# EAGLE design ACC (EAGLE 9.6.2)
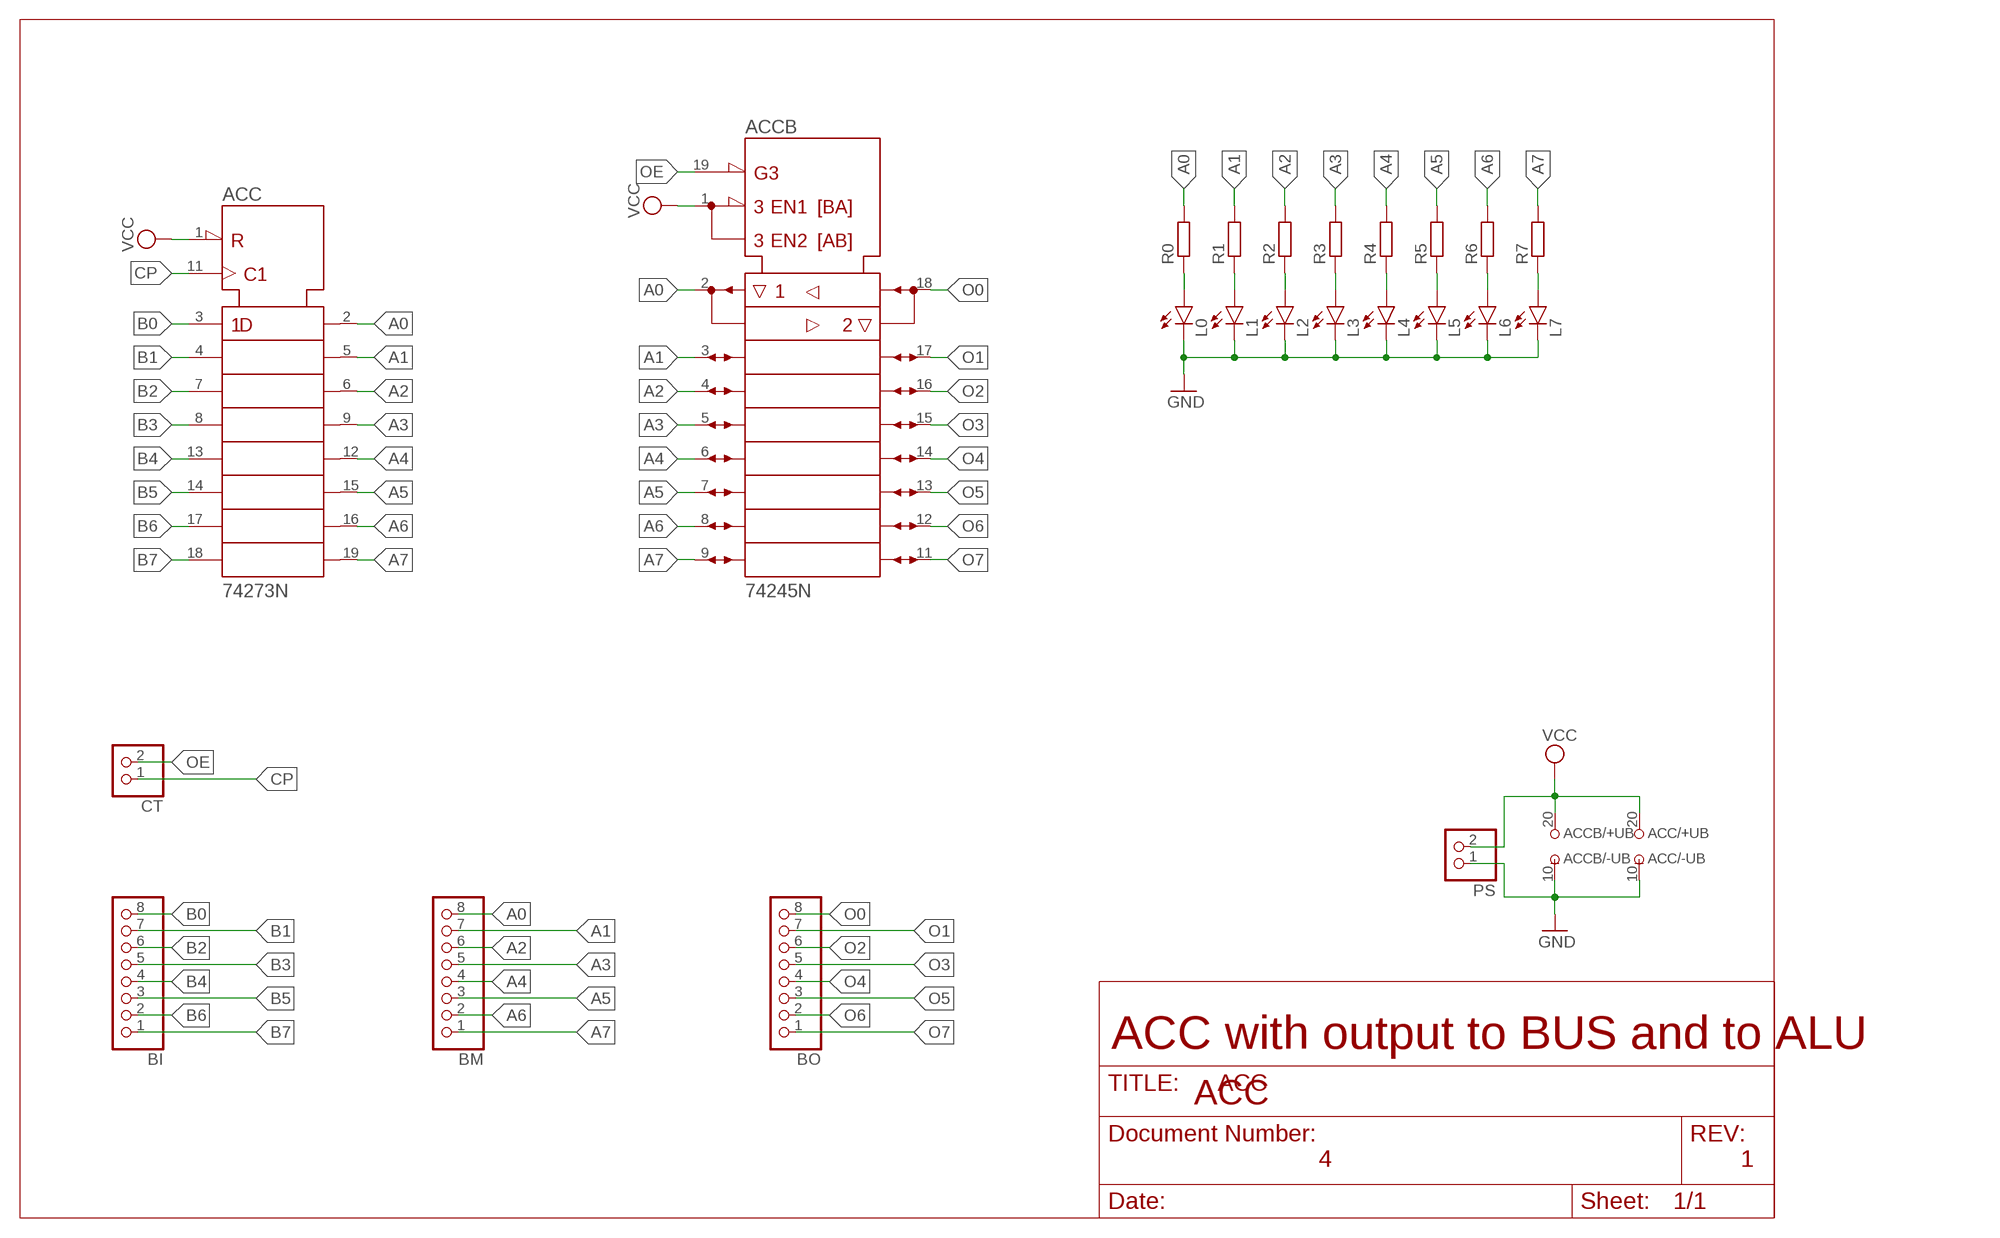
[diagram p0: schematic, sheet 1]

## Parts
ACC  74273N  [DIL20]
ACCB  74245N  [DIL20]
BI  PINHD-1X8  [1X08]
BM  PINHD-1X8  [1X08]
BO  PINHD-1X8  [1X08]
CT  PINHD-1X2  [1X02]
L0  LED5MM  [LED5MM]
L1  LED5MM  [LED5MM]
L2  LED5MM  [LED5MM]
L3  LED5MM  [LED5MM]
L4  LED5MM  [LED5MM]
L5  LED5MM  [LED5MM]
L6  LED5MM  [LED5MM]
L7  LED5MM  [LED5MM]
PS  PINHD-1X2  [1X02]
R0  R-EU_0204/7  [0204/7]
R1  R-EU_0204/7  [0204/7]
R2  R-EU_0204/7  [0204/7]
R3  R-EU_0204/7  [0204/7]
R4  R-EU_0204/7  [0204/7]
R5  R-EU_0204/7  [0204/7]
R6  R-EU_0204/7  [0204/7]
R7  R-EU_0204/7  [0204/7]

## Nets
A0: ACC.2(1Q) ACCB.2(A1) BM.8 R0.2
A1: ACC.5(2Q) ACCB.3(A2) BM.7 R1.2
A2: ACC.6(3Q) ACCB.4(A3) BM.6 R2.2
A3: ACC.9(4Q) ACCB.5(A4) BM.5 R3.2
A4: ACC.12(5Q) ACCB.6(A5) BM.4 R4.2
A5: ACC.15(6Q) ACCB.7(A6) BM.3 R5.2
A6: ACC.16(7Q) ACCB.8(A7) BM.2 R6.2
A7: ACC.19(8Q) ACCB.9(A8) BM.1 R7.2
B0: ACC.3(1D) BI.8
B1: ACC.4(2D) BI.7
B2: ACC.7(3D) BI.6
B3: ACC.8(4D) BI.5
B4: ACC.13(5D) BI.4
B5: ACC.14(6D) BI.3
B6: ACC.17(7D) BI.2
B7: ACC.18(8D) BI.1
CP: ACC.11(CLK) CT.1
GND: ACC.10(-UB) ACCB.10(-UB) L0.K(C) L1.K(C) L2.K(C) L3.K(C) L4.K(C) L5.K(C) L6.K(C) L7.K(C) PS.1
N$1: L0.A R0.1
N$4: L1.A R1.1
N$7: L2.A R2.1
N$26: L3.A R3.1
N$29: L4.A R4.1
N$32: L5.A R5.1
N$35: L6.A R6.1
N$38: L7.A R7.1
O0: ACCB.18(B1) BO.8
O1: ACCB.17(B2) BO.7
O2: ACCB.16(B3) BO.6
O3: ACCB.15(B4) BO.5
O4: ACCB.14(B5) BO.4
O5: ACCB.13(B6) BO.3
O6: ACCB.12(B7) BO.2
O7: ACCB.11(B8) BO.1
OE: ACCB.19(!G) CT.2
VCC: ACC.1(!CLR) ACC.20(+UB) ACCB.1(DIR) ACCB.20(+UB) PS.2

## Notes on the sheet
- ACC with output to BUS and to ALU
- ACC
- 4 | 1

## Library data of the parts
ACC = 74ttl-din:74*273: Octal D type FLIP FLOP, clear
ACCB = 74ttl-din:74*245: Octal BUS TRANSCEIVER, 3-state
BI BM BO = pinhead:PINHD-1X8: PIN HEADER
CT PS = pinhead:PINHD-1X2: PIN HEADER
L0 L1-L7 = led:LED: LED OSRAM: - CHIPLED LG R971, LG N971, LY N971, LG Q971, LY Q971, LO R971, LY R971 LH N974, LH R974 LS Q976, LO Q976, LY Q976 LO Q996 - Hyper CHIPLED LW Q18S LB Q993, LB Q99A, LB R99A - SideLED LS A670, LO A670, LY A670, LG A670, LP A670 LB A673, LV A673, LT A673, LW A673 LH A674 LY A675 LS A676, LA A676, LO A676, LY A676, LW A676 LS A679, LY A679, LG A679 - Hyper Micro SIDELED® LS Y876, LA Y876, LO Y876, LY Y876 LT Y87S - SmartLED LW L88C, LW L88S LB L89C, LB L89S, LG L890 LS L89K, LO L89K, LY L89K LS L896, LA L896, LO L896, LY L896 - TOPLED LS T670, LO T670, LY T670, LG T670, LP T670 LSG T670, LSP T670, LSY T670, LOP T670, LYG T670 LG T671, LOG T671, LSG T671 LB T673, LV T673, LT T673, LW T673 LH T674 LS T676, LA T676, LO T676, LY T676, LB T676, LH T676, LSB T676, LW T676 LB T67C, LV T67C, LT T67C, LS T67K, LO T67K, LY T67K, LW E67C LS E67B, LA E67B, LO E67B, LY E67B, LB E67C, LV E67C, LT E67C LW T67C LS T679, LY T679, LG T679 LS T770, LO T770, LY T770, LG T770, LP T770 LB T773, LV T773, LT T773, LW T773 LH T774 LS E675, LA E675, LY E675, LS T675 LS T776, LA T776, LO T776, LY T776, LB T776 LHGB T686 LT T68C, LB T68C - Hyper Mini TOPLED® LB M676 - Mini TOPLED Santana® LG M470 LS M47K, LO M47K, LY M47K Source: http://www.osram.convergy.de LUXEON: - LUMILED® LXK2-PW12-R00, LXK2-PW12-S00, LXK2-PW14-U00, LXK2-PW14-V00 LXK2-PM12-R00, LXK2-PM12-S00, LXK2-PM14-U00 LXK2-PE12-Q00, LXK2-PE12-R00, LXK2-PE12-S00, LXK2-PE14-T00, LXK2-PE14-U00 LXK2-PB12-K00, LXK2-PB12-L00, LXK2-PB12-M00, LXK2-PB14-N00, LXK2-PB14-P00, LXK2-PB14-Q00 LXK2-PR12-L00, LXK2-PR12-M00, LXK2-PR14-Q00, LXK2-PR14-R00 LXK2-PD12-Q00, LXK2-PD12-R00, LXK2-PD12-S00 LXK2-PH12-R00, LXK2-PH12-S00 LXK2-PL12-P00, LXK2-PL12-Q00, LXK2-PL12-R00 Source: www.luxeon.com KINGBRIGHT: KA-3528ASYC Source: www.kingbright.com
R0 R1-R7 = rcl:R-EU_: RESISTOR, European symbol; SPICEPREFIX: R

## Board
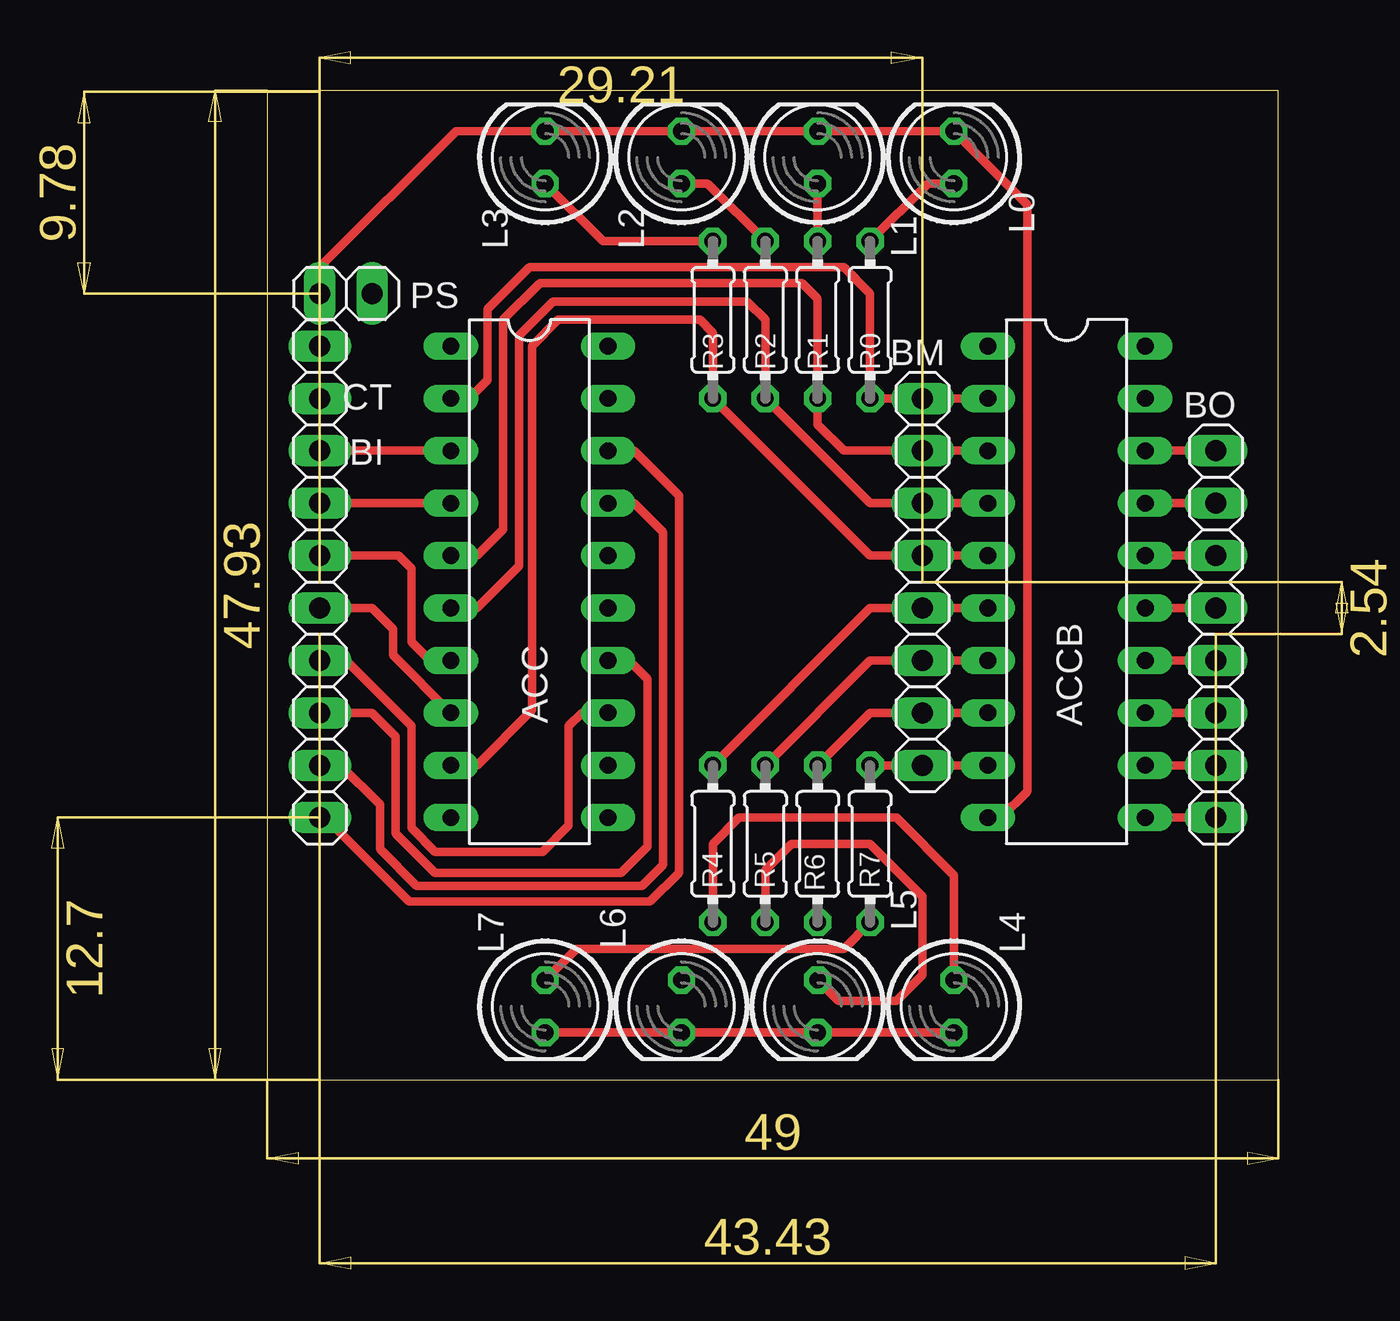
[diagram p1: board, top side]
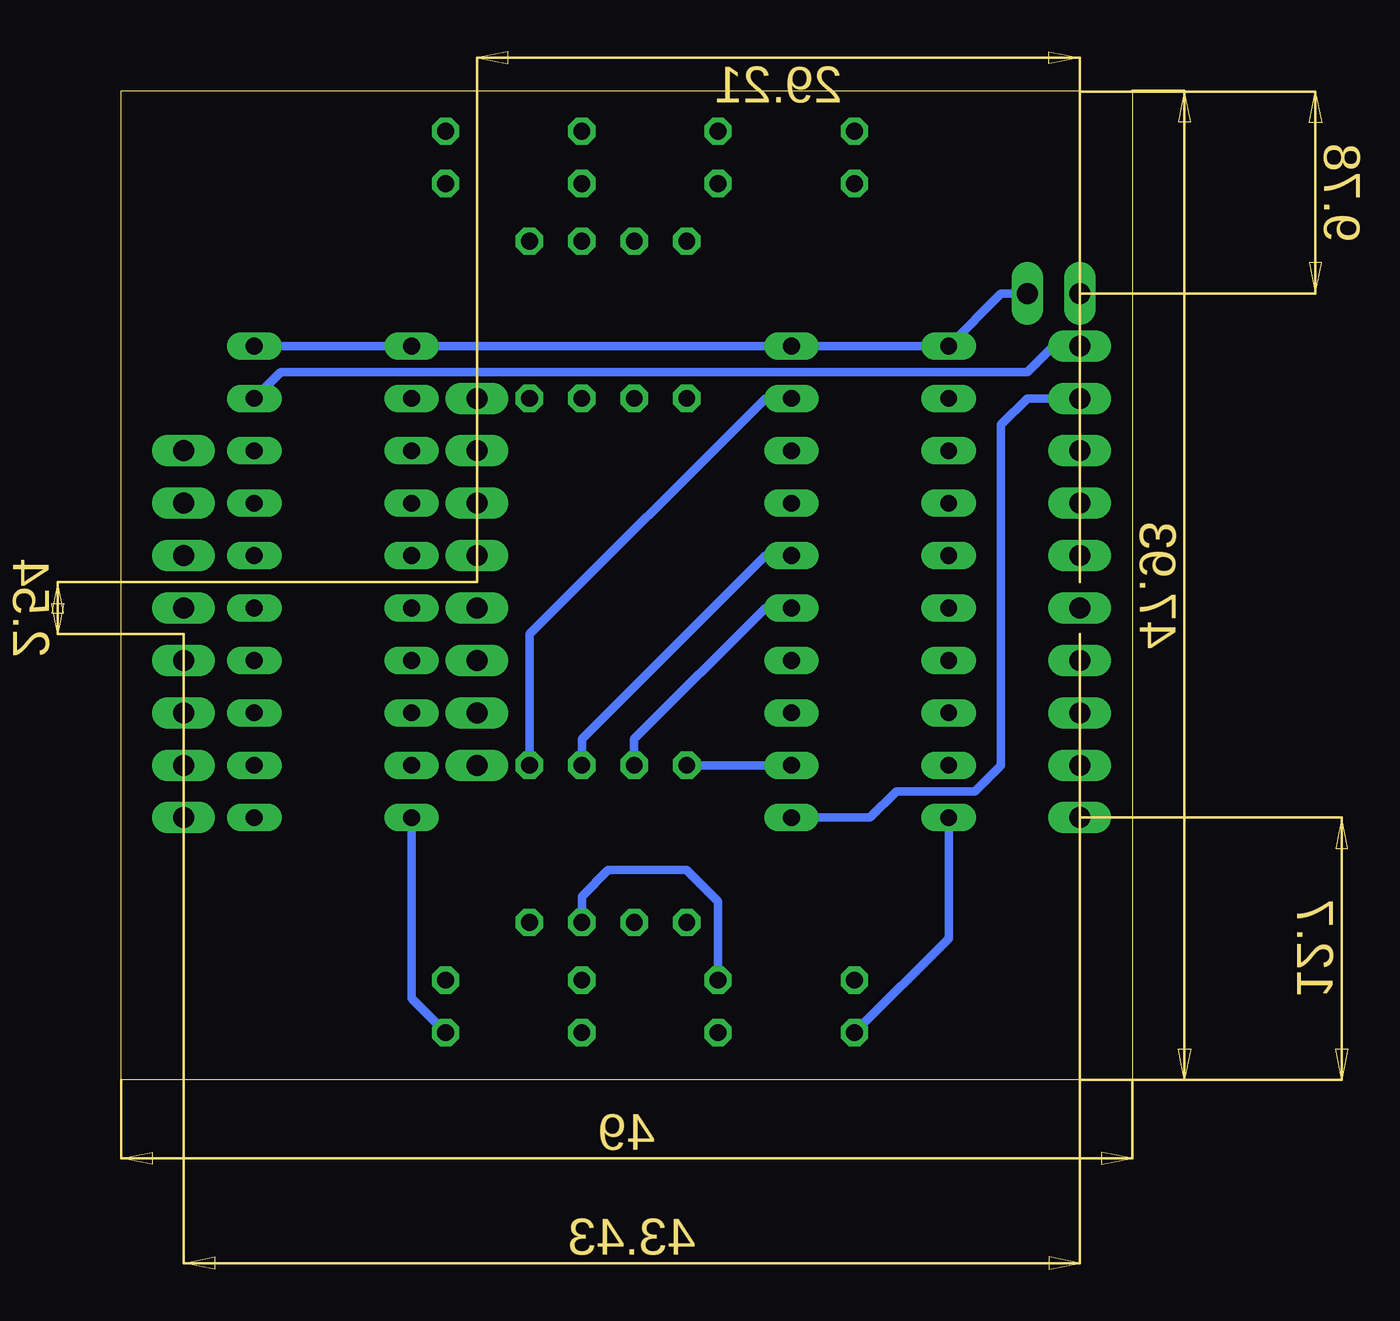
[diagram p2: board, bottom side, seen from below]

Size 49 x 47.93 mm. Coordinates in mm from the lower left corner, seen from the top.
Outline: 0,0 49,0 49,47.93 0,47.93 0,0
Copper layers (1*16): Top 0.035mm / dielectric 1.5mm / Bottom 0.035mm
Design rules "default": minimum track width 6mil, minimum drill 0.35mm, track to track 6mil, track to pad 6mil, pad to pad 6mil, via to via 6mil, smd to smd 6mil, copper to edge 40mil, drill to drill 6mil, minimum pad ring 10mil, minimum via ring 8mil, stop-mask expansion 4mil, vias tented up to drill 0mil, thermal gap 10mil

### Footprints (pad centres in the part's own frame; a part is rotated, then mirrored left to right if it is on the bottom)
DIL20 = drill 0.813 long: 1 -11.43,-3.81; 2 -8.89,-3.81; 3 -6.35,-3.81; 4 -3.81,-3.81; 5 -1.27,-3.81; 6 1.27,-3.81; 7 3.81,-3.81; 8 6.35,-3.81; 9 8.89,-3.81; 10 11.43,-3.81; 11 11.43,3.81; 12 8.89,3.81; 13 6.35,3.81; 14 3.81,3.81; 15 1.27,3.81; 16 -1.27,3.81; 17 -3.81,3.81; 18 -6.35,3.81; 19 -8.89,3.81; 20 -11.43,3.81
1X08 = drill 1.016 long: 1 -8.89,0; 2 -6.35,0; 3 -3.81,0; 4 -1.27,0; 5 1.27,0; 6 3.81,0; 7 6.35,0; 8 8.89,0
1X02 = drill 1.016 long: 1 -1.27,0; 2 1.27,0
LED5MM = drill 0.813 octagon: A -1.27,0; K 1.27,0
0204/7 = drill 0.813 octagon: 1 -3.81,0; 2 3.81,0

### Placement (x,y rotation side)
ACC  12.7,24.13 270 top
ACCB  38.73,24.13 270 top
BI  2.54,21.59 90 top
BM  31.75,24.13 90 top
BO  45.97,21.59 90 top
CT  2.54,34.29 90 top
L0  33.27,44.7 90 top
L1  26.67,44.7 90 top
L2  20.07,44.7 90 top
L3  13.46,44.7 90 top
L4  33.27,3.56 270 top
L5  26.67,3.56 270 top
L6  20.07,3.56 270 top
L7  13.46,3.56 270 top
PS  3.81,38.1 0 top
R0  29.21,36.83 270 top
R1  26.67,36.83 270 top
R2  24.13,36.83 270 top
R3  21.59,36.83 270 top
R4  21.59,11.43 90 top
R5  24.13,11.43 90 top
R6  26.67,11.43 90 top
R7  29.21,11.43 90 top

### Tracks (layer width: path | path; a pad name or v marks a point on that pad's centre or on a via)
A0
  Top 0.4: ACCB.2 BM.8 R0.2 29.21,38.1 27.94,39.37 12.7,39.37 10.67,37.34 10.67,33.91 9.78,33.02 ACC.2
A1
  Top 0.4: ACCB.3 BM.7 27.94,30.48 26.67,31.75 R1.2 26.67,37.85 25.91,38.61 13.21,38.61 11.43,36.83 11.43,26.67 10.16,25.4 ACC.5
A2
  Top 0.4: ACCB.4 BM.6 29.21,27.94 R2.2 24.13,36.83 23.24,37.72 13.84,37.72 12.19,36.07 12.19,24.89 10.16,22.86 ACC.6
A3
  Top 0.4: ACCB.5 BM.5 29.21,25.4 R3.2 21.59,36.2 20.95,36.83 14.1,36.83 12.83,35.56 12.83,17.91 10.16,15.24 ACC.9
A4
  Top 0.4: ACCB.6 BM.4 29.21,22.86 R4.2
  Bottom 0.4: ACC.12 R4.2
A5
  Top 0.4: ACCB.7 BM.3 29.21,20.32 R5.2
  Bottom 0.4: R5.2 24.13,16.51 17.78,22.86 ACC.15
A6
  Top 0.4: ACCB.8 BM.2 29.21,17.78 R6.2
  Bottom 0.4: ACC.16 17.78,25.4 26.67,16.51 R6.2
A7
  Top 0.4: ACCB.9 BM.1 R7.2
  Bottom 0.4: R7.2 29.21,21.59 17.78,33.02 ACC.19
B0
  Top 0.4: BI.8 ACC.3
B1
  Top 0.4: BI.7 ACC.4
B2
  Top 0.4: BI.6 6.35,25.4 6.99,24.77 6.99,21.21 7.87,20.32 ACC.7
B3
  Top 0.4: ACC.8 6.1,20.57 6.1,21.84 5.08,22.86 BI.5
B4
  Top 0.4: ACC.13 15.24,17.78 14.61,17.14 14.61,12.32 13.34,11.05 8.13,11.05 6.99,12.19 6.99,17.14 3.81,20.32 BI.4
B5
  Top 0.4: BI.3 5.08,17.78 6.22,16.64 6.22,11.94 8.13,10.03 17.14,10.03 18.41,11.3 18.41,19.43 17.53,20.32 ACC.14
B6
  Top 0.4: ACC.17 17.78,27.94 19.18,26.54 19.18,10.41 18.16,9.4 7.24,9.4 5.46,11.18 5.46,13.34 3.56,15.24 BI.2
B7
  Top 0.4: ACC.18 17.78,30.48 19.94,28.32 19.94,10.03 18.54,8.64 6.86,8.64 2.79,12.7 BI.1
CP
  Bottom 0.4: ACC.11 12.7,12.7 11.43,13.97 7.62,13.97 6.35,15.24 6.35,31.75 5.08,33.02 CT.1
GND
  Top 0.4: L7.K L6.K L5.K L4.K | PS.1 2.54,39.37 9.14,45.97 L3.K L2.K L1.K L0.K 36.83,42.42 36.83,13.97 35.56,12.7 ACCB.10
  Bottom 0.4: L7.K 8.89,6.86 ACC.10 | L4.K 34.92,3.94 ACCB.10
N$1
  Top 0.4: R0.1 32,43.43 L0.A
N$4
  Top 0.4: R1.1 L1.A
N$7
  Top 0.4: R2.1 21.34,43.43 L2.A
N$26
  Top 0.4: R3.1 16.26,40.64 L3.A
N$29
  Top 0.4: R4.1 21.59,11.43 22.86,12.7 30.48,12.7 33.27,9.91 L4.A
N$32
  Top 0.4: R5.1 24.13,10.16 25.4,11.43 29.21,11.43 31.75,8.89 31.75,5.08 30.48,3.81 27.69,3.81 L5.A
N$35
  Bottom 0.4: R6.1 26.67,8.89 25.4,10.16 21.59,10.16 20.07,8.64 L6.A
N$38
  Top 0.4: R7.1 27.94,6.35 14.99,6.35 L7.A
O0
  Top 0.4: ACCB.18 BO.8
O1
  Top 0.4: BO.7 ACCB.17
O2
  Top 0.4: ACCB.16 BO.6
O3
  Top 0.4: BO.5 ACCB.15
O4
  Top 0.4: ACCB.14 BO.4
O5
  Top 0.4: BO.3 ACCB.13
O6
  Top 0.4: ACCB.12 BO.2
O7
  Top 0.4: BO.1 ACCB.11
OE
  Bottom 0.4: CT.2 3.81,35.56 5.08,34.29 41.27,34.29 ACCB.19
VCC
  Bottom 0.4: PS.2 6.35,38.1 ACC.1 ACC.20 ACCB.1 ACCB.20